# EAGLE design shield-V1p2 (EAGLE 6.5.0)
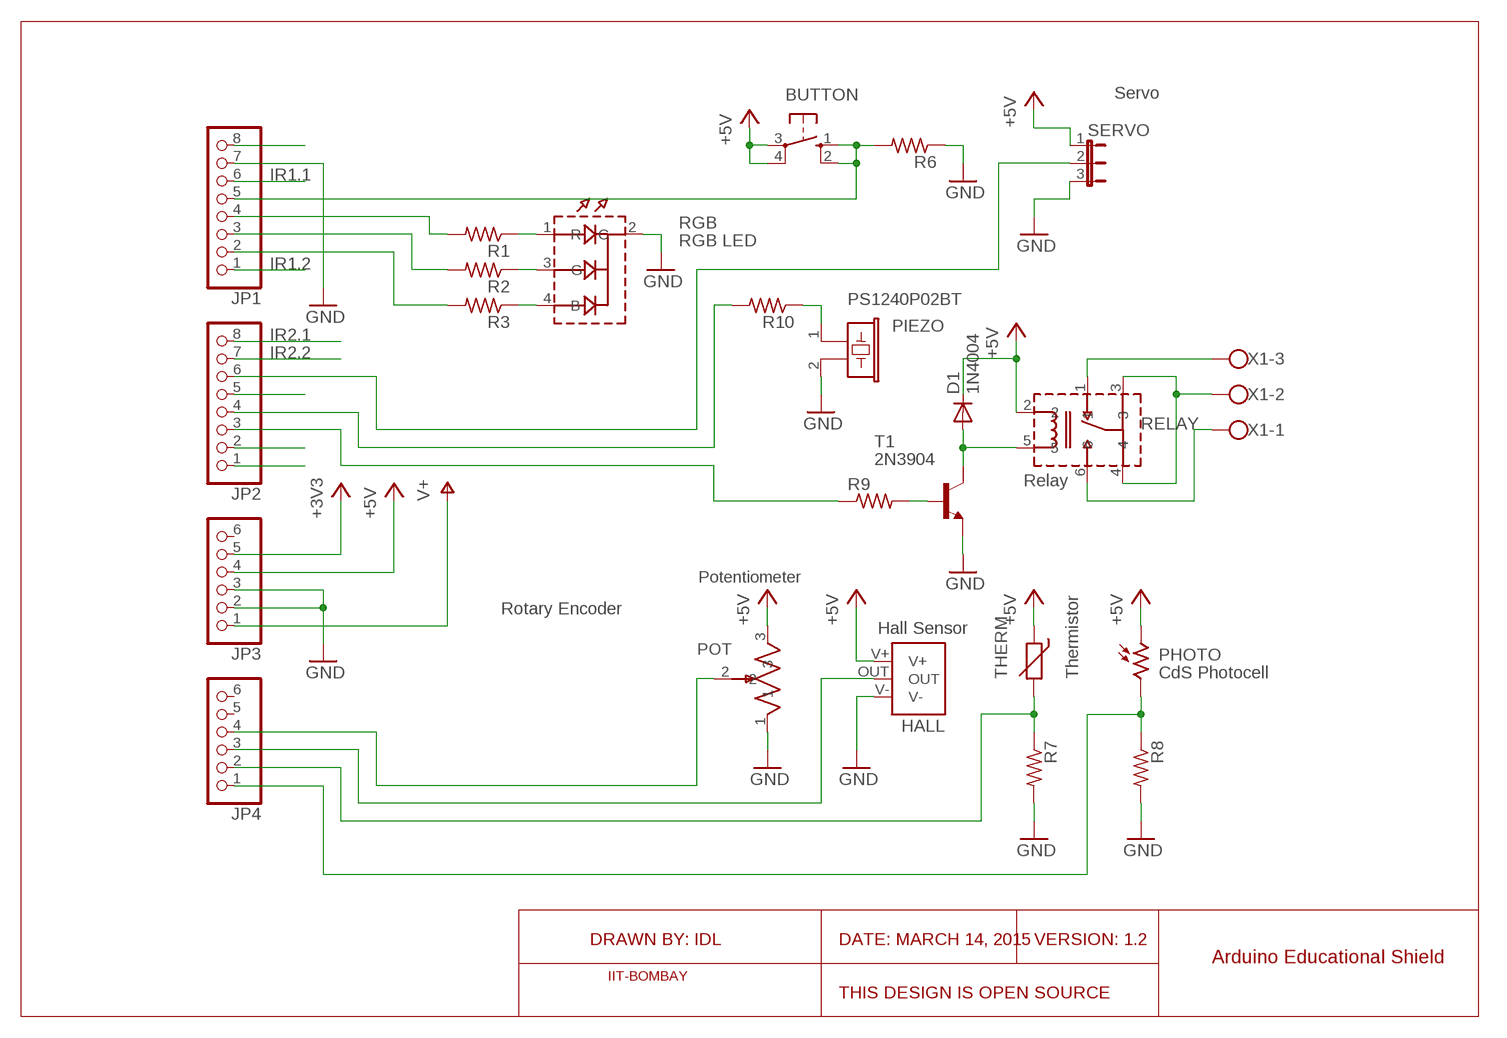
[diagram p0: schematic, sheet 1]

## Parts
BUTTON  10-XX  [B3F-10XX]
D1  1N4004  [DO41-10]
HALL  SS49E  [TO_92_SHORT]
JP1  PINHD-1X8  [1X08]
JP2  PINHD-1X8  [1X08]
JP3  PINHD-1X6  [1X06]
JP4  PINHD-1X6  [1X06]
PHOTO  CdS Photocell  VT20N1  [TO46-VT200]
PIEZO  PS1240P02BT  [PS1240P02BT]
POT  EVU_POTENTIOMETER  [VERT_POT]
R1  R-US_0207/10  [0207/10]
R2  R-US_0207/10  [0207/10]
R3  R-US_0207/10  [0207/10]
R6  R-US_0207/10  [0207/10]
R7  R-US_0207/10  [0207/10]
R8  R-US_0207/10  [0207/10]
R9  R-US_0207/10  [0207/10]
R10  R-US_0207/10  [0207/10]
RELAY  TSC_1FORMC  [TSC_RELAY]
RGB  RGB LED  RGBLED_COMMON_CATHODE  [RGB_VERTICAL]
SERVO  JP2E  [JP2]
T1  2N3904  [TO92]
THERM  Thermistor  THERMISTOR-5  [R-5]
X1  W237-103  [W237-103]

## Nets
+3V3: JP3.5
+5V: BUTTON.3(P) BUTTON.4(P1) D1.C HALL.V+ JP3.4 PHOTO.1 POT.3 RELAY.2 SERVO.1 THERM.1
BLUE: JP1.3 R2.2
BUTTON: BUTTON.1(S) BUTTON.2(S1) JP1.5 R6.2
GND: HALL.V- JP1.7 JP3.2 JP3.3 PIEZO.2 POT.1 R6.1 R7.2 R8.2 RGB.2(C) SERVO.3 T1.3(E)
GREEN: JP1.2 R3.2
HALL_SENSOR: HALL.OUT JP4.3
IR1.1: JP1.6
IR1.2: JP1.1
IR2.1: JP2.8
IR2.2: JP2.7
N$1: R1.1 RGB.1(R)
N$2: R2.1 RGB.3(G)
N$3: R3.1 RGB.4(B)
N$4: PIEZO.1 R10.1
N$5: JP1.8
N$6: D1.A RELAY.5 T1.1(C)
N$9: RELAY.1 X1.3
N$10: RELAY.3 RELAY.4 X1.2
N$12: RELAY.6 X1.1
N$13: R9.2 T1.2(B)
PHOTOCELL: JP4.1 PHOTO.2 R8.1
PIEZO: JP2.4 R10.2
POTENTIOMETER: JP4.4 POT.2
RED: JP1.4 R1.2
RELAY: JP2.3 R9.1
SERVO: JP2.6 SERVO.2
THERMISTOR: JP4.2 R7.1 THERM.2
UNUSED3: JP2.5
UNUSED4: JP2.2
UNUSED5: JP2.1
V+: JP3.1
Unconnected: JP3.6 JP4.5 JP4.6

## Notes on the sheet
- Servo
- Relay
- Potentiometer
- Rotary Encoder
- Hall Sensor
- DRAWN BY: IDL | DATE: MARCH 14, 2015 | VERSION: 1.2
- Arduino Educational Shield
- IIT-BOMBAY
- THIS DESIGN IS OPEN SOURCE

## Library data of the parts
BUTTON = switch-omron:10-XX: OMRON SWITCH
D1 = diode:1N4004: DIODE general purpose rectifier, 1 A
HALL = CodeShield Parts:SS49E: Honeywell SS49E series Hall Effect Sensor Sensing range: 1mV/G ~ 1.75mV/G Type: Linear Voltage: 2.7V - 6.5V Supply Current: 10mA Output: Analog
JP1 JP2 = pinhead:PINHD-1X8: PIN HEADER
JP3 JP4 = pinhead:PINHD-1X6: PIN HEADER
PHOTO = photo-elements:VT2*: Photoconductive Cell VT200 Series Source: http://optoelectronics.perkinelmer.com/content/Datasheets/DTS_vt200seriesdatasheet.pdf
PIEZO = buzzer:PS1240P02BT: TDK piezo buzzer, 5mm pin pitch, 12.2mm diameter
POT = CodeShield Parts:EVU_POTENTIOMETER: Panasonic EVU-series potentiometer 6mm flatted shaft vertical orientation
R1-R3 R6-R10 = rcl:R-US_: RESISTOR, American symbol
RELAY = CodeShield Parts:TSC_1FORMC: Tyco Electronics TSC-series relay. 1 FORM C topology; ON-(ON)
RGB = RGB LED:RGBLED_COMMON_CATHODE: Common Cathode RGB LED mounted vertically
SERVO = jumper:JP2E: JUMPER
T1 = transistor:2N3904: NPN TRANSISTOR
THERM = varistor:THERMISTOR: THERMISTOR
X1 = con-wago-500:W237-103: WAGO SCREW CLAMP

## Board
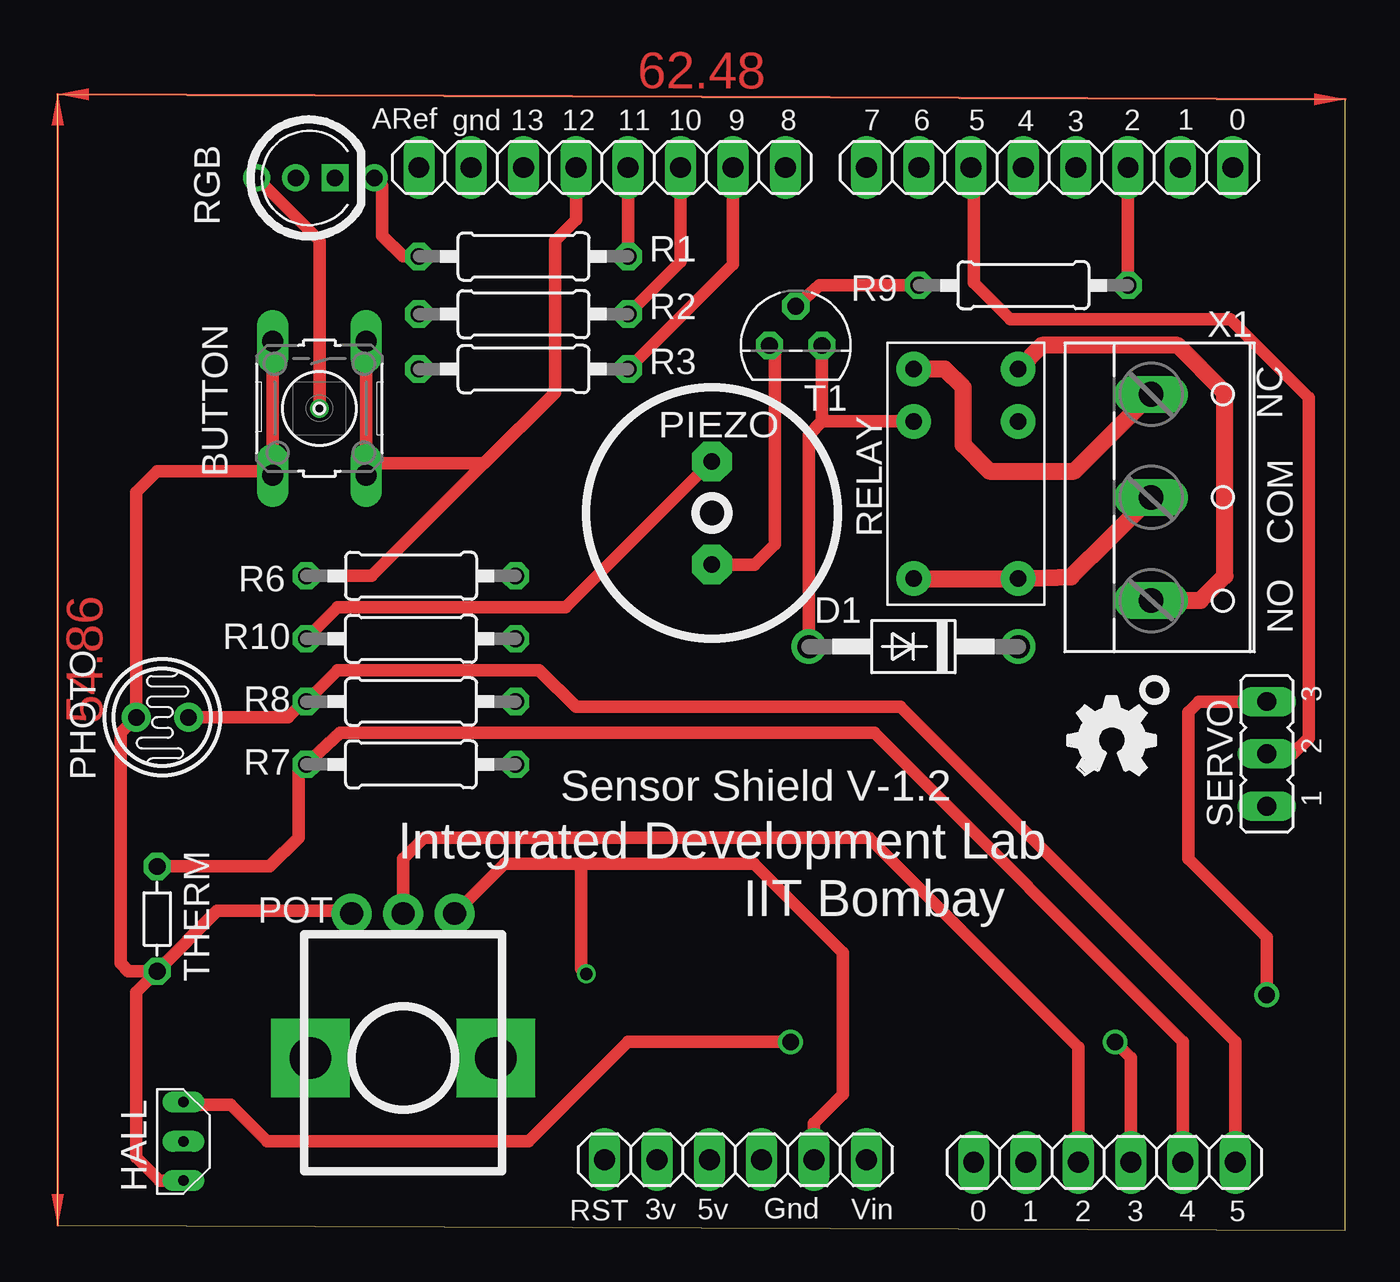
[diagram p1: board, top side]
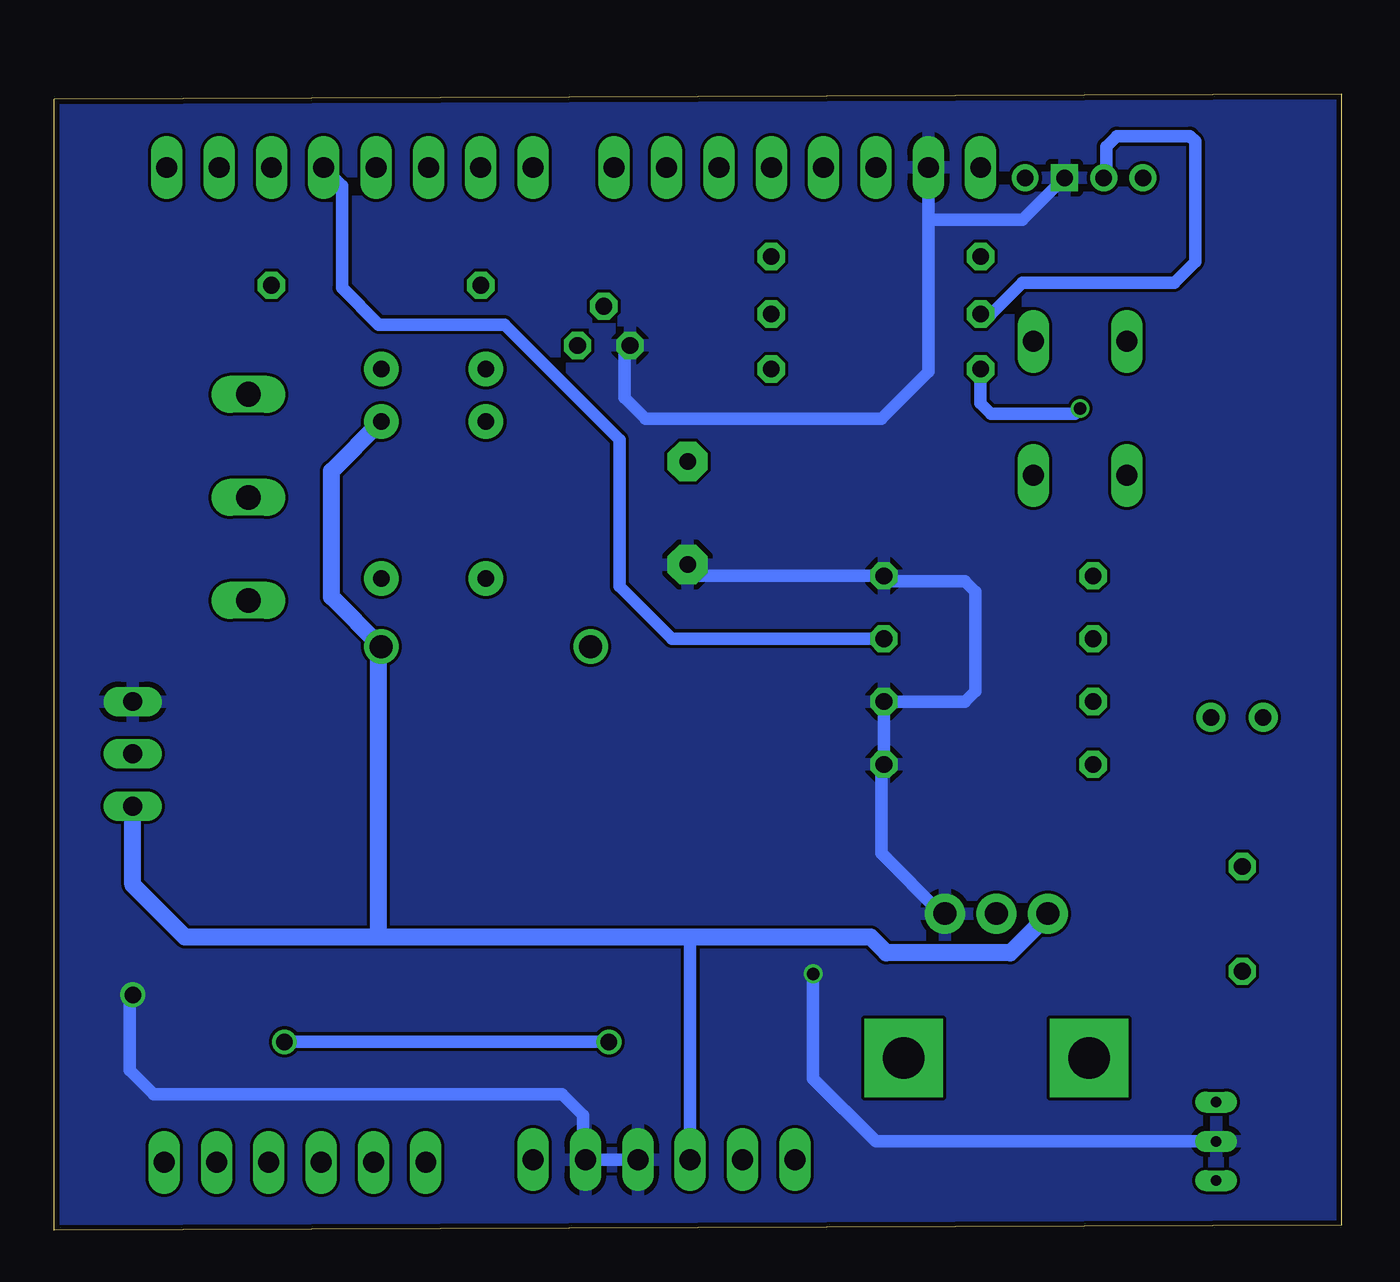
[diagram p2: board, bottom side, seen from below]

Size 62.48 x 55.12 mm. Coordinates in mm from the lower left corner, seen from the top.
Outline: 0,0.25 62.48,0 62.48,54.86 0,55.12 0,0.25
Copper layers (1*16): Top 0.035mm / dielectric 1.5mm / Bottom 0.035mm
Design rules "default": minimum track width 6mil, minimum drill 12mil, track to track 6mil, track to pad 6mil, pad to pad 6mil, via to via 6mil, smd to smd 0mil, copper to edge 10mil, drill to drill 10mil, minimum pad ring 10mil, minimum via ring 6mil, stop-mask expansion 2mil, vias tented up to drill 100mil, thermal gap 10mil

### Footprints (pad centres in the part's own frame; a part is rotated, then mirrored left to right if it is on the bottom)
B3F-10XX = drill 1.016 long: 1 -3.251,2.261; 2 3.251,2.261; 3 -3.251,-2.261; 4 3.251,-2.261
DO41-10 = drill 1.118: A 5.08,0; C -5.08,0
TO_92_SHORT = drill 0.5 long: OUT 1.905,0; V+ -1.905,0; V- 0,0
1X08 = drill 1.016 long: 1 -8.89,0; 2 -6.35,0; 3 -3.81,0; 4 -1.27,0; 5 1.27,0; 6 3.81,0; 7 6.35,0; 8 8.89,0
1X06 = drill 1.016 long: 1 -6.35,0; 2 -3.81,0; 3 -1.27,0; 4 1.27,0; 5 3.81,0; 6 6.35,0
TO46-VT200 = drill 0.8 pad 1.4: 1 -1.27,0; 2 1.27,0
PS1240P02BT = drill 0.8 pad 1.93 octagon: 1 -2.5,0; 2 2.5,0
VERT_POT = drill 1.1 pad 1.93: 1 -2.5,0; 2 0,0; 3 2.5,0 | drill 2 pad 3.81 square: P$4 -4.5,7; P$5 4.5,7
0207/10 = drill 0.813 octagon: 1 -5.08,0; 2 5.08,0
TSC_RELAY = drill 0.8 pad 1.676: 1 -5.08,2.54; 2 -2.54,2.54; 3 5.08,2.54; 4 5.08,-2.54; 5 -2.54,-2.54; 6 -5.08,-2.54
RGB_VERTICAL = drill 0.8: 1 3.81,0; 3 0,0; 4 -1.905,0 | drill 0.8 square: 2 1.905,0
JP2 = drill 0.914 long: 1 -2.54,0; 2 0,0; 3 2.54,0
TO92 = drill 0.813 octagon: 1 1.27,0; 2 0,1.905; 3 -1.27,0
R-5 = drill 0.813 octagon: 1 -2.54,0; 2 2.54,0
W237-103 = drill 1.194 long: 1 -5,-1.29; 2 0,-1.29; 3 5,-1.29

### Placement (x,y rotation side)
BUTTON  12.7,39.88 270 top
D1  41.53,28.32 180 top
HALL  6.1,4.32 90 top
JP1  26.42,51.56 180 top
JP2  48.13,51.56 180 top
JP3  32.89,3.43 180 top
JP4  50.8,3.3 180 top
PHOTO  5.08,24.89 0 top
PIEZO  31.75,34.8 270 top
POT  16.76,15.37 180 top
R1  22.61,47.24 0 top
R2  22.61,44.45 0 top
R3  22.61,41.78 0 top
R6  17.14,31.75 180 top
R7  17.14,22.61 0 top
R8  17.14,25.65 0 top
R9  46.86,45.85 180 top
R10  17.14,28.7 0 top
RELAY  44.07,36.7 270 top
RGB  11.56,51.05 0 top
SERVO  58.67,23.11 90 top
T1  35.81,42.93 0 top
THERM  4.83,15.11 90 top
U$1  [OSHW_FILLX150_NOTEXT]  49.02,22.1 0 top
X1  54.36,35.56 270 top

### Tracks (layer width: path | path; a pad name or v marks a point on that pad's centre or on a via)
+5V
  Top 0.61: BUTTON.3 BUTTON.4 10.24,36.83 4.83,36.83 3.81,35.81 PHOTO.1 3.05,24.13 3.05,12.95 3.43,12.57 THERM.1 | THERM.1 7.75,15.49 13.72,15.49 13.84,15.37 POT.3 | THERM.1 3.81,11.56 3.81,3.56 4.95,2.41 HALL.V+
  Bottom 0.61: 46.74,28.19 D1.C | POT.3 14.22,15.33 | 31.62,14.1 JP3.4
  Bottom 0.813: D1.C 49.02,30.73 49.02,36.83 RELAY.2 | 46.74,14.22 56.13,14.22 58.67,16.76 SERVO.1 | 46.74,14.22 46.74,28.19 | 31.75,14.22 22.86,14.22 22.1,13.46 16.09,13.46 14.22,15.33 | 31.75,14.22 46.74,14.22 | 31.75,14.22 31.62,14.1
BLUE
  Top 0.61: R2.2 30.23,46.99 JP1.3
BUTTON
  Top 0.61: JP1.5 25.15,49.02 24.13,48.01 24.13,40.64 20.7,37.21 | R6.2 15.24,31.75 20.7,37.21 | BUTTON.1 BUTTON.2 15.54,37.21 20.7,37.21
GND  (via drill 0.6, 0.8)
  Top 0.61: T1.3 34.8,42.67 34.8,33.27 33.82,32.3 PIEZO.2 | POT.1 21.68,17.78 25.4,17.78 | 25.4,17.78 33.78,17.78 38.1,13.46 38.1,6.6 36.7,5.21 JP3.2 | SERVO.3 55.37,25.65 54.86,25.15 54.86,18.03 58.67,14.22 v58.67,11.43 | v25.65,12.45 25.4,12.7 25.4,17.78
  Bottom 0.254: JP3.2 36.83,3.56
  Bottom 0.406: v58.67,11.43 58.83,11.28
  Bottom 0.61: PIEZO.2 31.2,31.75 R6.1 22.1,31.75 21.84,31.5 18.29,31.5 17.78,30.99 17.78,26.16 18.29,25.65 R8.2 R7.2 22.35,22.48 22.35,18.29 19.43,15.37 POT.1 | JP3.3 JP3.2 | 36.83,3.56 36.83,5.59 37.85,6.6 57.66,6.6 58.83,7.77 58.83,11.28 | T1.3 34.8,42.67 34.8,40.39 33.78,39.37 22.35,39.37 20.07,41.66 20.07,49.02 | 20.07,49.02 JP1.7 | RGB.2 15.49,49.02 20.07,49.02 | HALL.V- 22.61,4.32 25.65,7.37 v25.65,12.45
  pour Bottom: 0,55.12 62.36,54.86 62.36,0 0,0.25
GREEN
  Top 0.61: R3.2 32.77,46.86 JP1.2
HALL_SENSOR  (via drill 0.8)
  Top 0.61: HALL.OUT 6.22,6.1 8.38,6.1 10.16,4.32 22.86,4.32 27.69,9.14 v35.56,9.14 | v51.31,9.14 52.07,8.38 JP4.3
  Bottom 0.61: v35.56,9.14 v51.31,9.14
N$1
  Top 0.61: RGB.1 15.75,50.67 15.75,48.26 16.76,47.24 R1.1
N$2
  Bottom 0.61: RGB.3 11.43,51.18 11.43,52.58 10.92,53.09 7.37,53.09 7.11,52.83 7.11,46.99 8.13,45.97 15.49,45.97 17.02,44.45 R2.1
N$3  (via drill 0.6)
  Top 0.61: RGB.4 12.7,48.01 v12.7,39.88
  Bottom 0.61: v12.7,39.88 12.95,39.62 17.02,39.62 17.53,40.13 R3.1
N$4
  Top 0.61: PIEZO.1 31.71,37.3 24.64,30.23 13.59,30.23 R10.1
N$6
  Top 0.61: 37.08,39.24 T1.1 | 37.08,39.24 36.45,38.61 D1.A | 37.08,39.24 RELAY.5
N$9
  Top 0.813: RELAY.1 47.75,42.93 54.36,42.93 56.64,40.64 56.64,31.75 55.45,30.56 X1.3
N$10
  Top 0.813: RELAY.4 RELAY.3 49.17,31.7 X1.2
N$12
  Top 0.813: RELAY.6 43.05,41.78 43.94,40.89 43.94,38.1 45.21,36.83 49.34,36.83 X1.1
N$13
  Top 0.61: R9.2 36.96,45.85 T1.2
PHOTOCELL
  Top 0.61: JP4.1 57.15,9.14 40.89,25.4 25.15,25.4 23.37,27.18 13.59,27.18 R8.1 11.94,25.65 11.18,24.89 PHOTO.2
PIEZO
  Bottom 0.61: R10.2 32.51,28.7 35.05,31.24 35.05,38.35 40.64,43.94 46.74,43.94 48.51,45.72 48.51,50.67 JP2.4
POTENTIOMETER
  Top 0.61: JP4.4 49.53,8.89 39.37,19.05 17.78,19.05 16.76,18.03 POT.2
RED
  Top 0.61: JP1.4 R1.2
RELAY
  Top 0.61: R9.1 JP2.3
SERVO
  Top 0.406: JP2.6 44.45,51.43
  Top 0.61: 44.45,51.43 44.45,45.97 46.23,44.2 56.9,44.2 60.71,40.39 60.71,23.88 59.94,23.11 SERVO.2
THERMISTOR
  Top 0.61: JP4.2 54.61,9.14 39.62,24.13 13.72,24.13 R7.1 11.68,22.23 11.68,19.05 10.29,17.65 THERM.2
(copper drawn outside any net)
  shapes: Top area x2

### Text on the board
tPlace: ARef | gnd | 13 | 12 | 11 | 10 | 9 | 8 | 7 | 6 | 5 | 4 | 3 | 2 | 1 | 0 | RST | 3v | 5v | Gnd | Vin | 0 | 1 | 2 | 3 | 4 | 5
tNames: NC | COM | NO | Sensor Shield V-1.2 | Integrated Development Lab | IIT Bombay
Reference: 2.65" | 2.16" | 2.75"